# EAGLE schematic traffic-light (EAGLE 9.6.2)
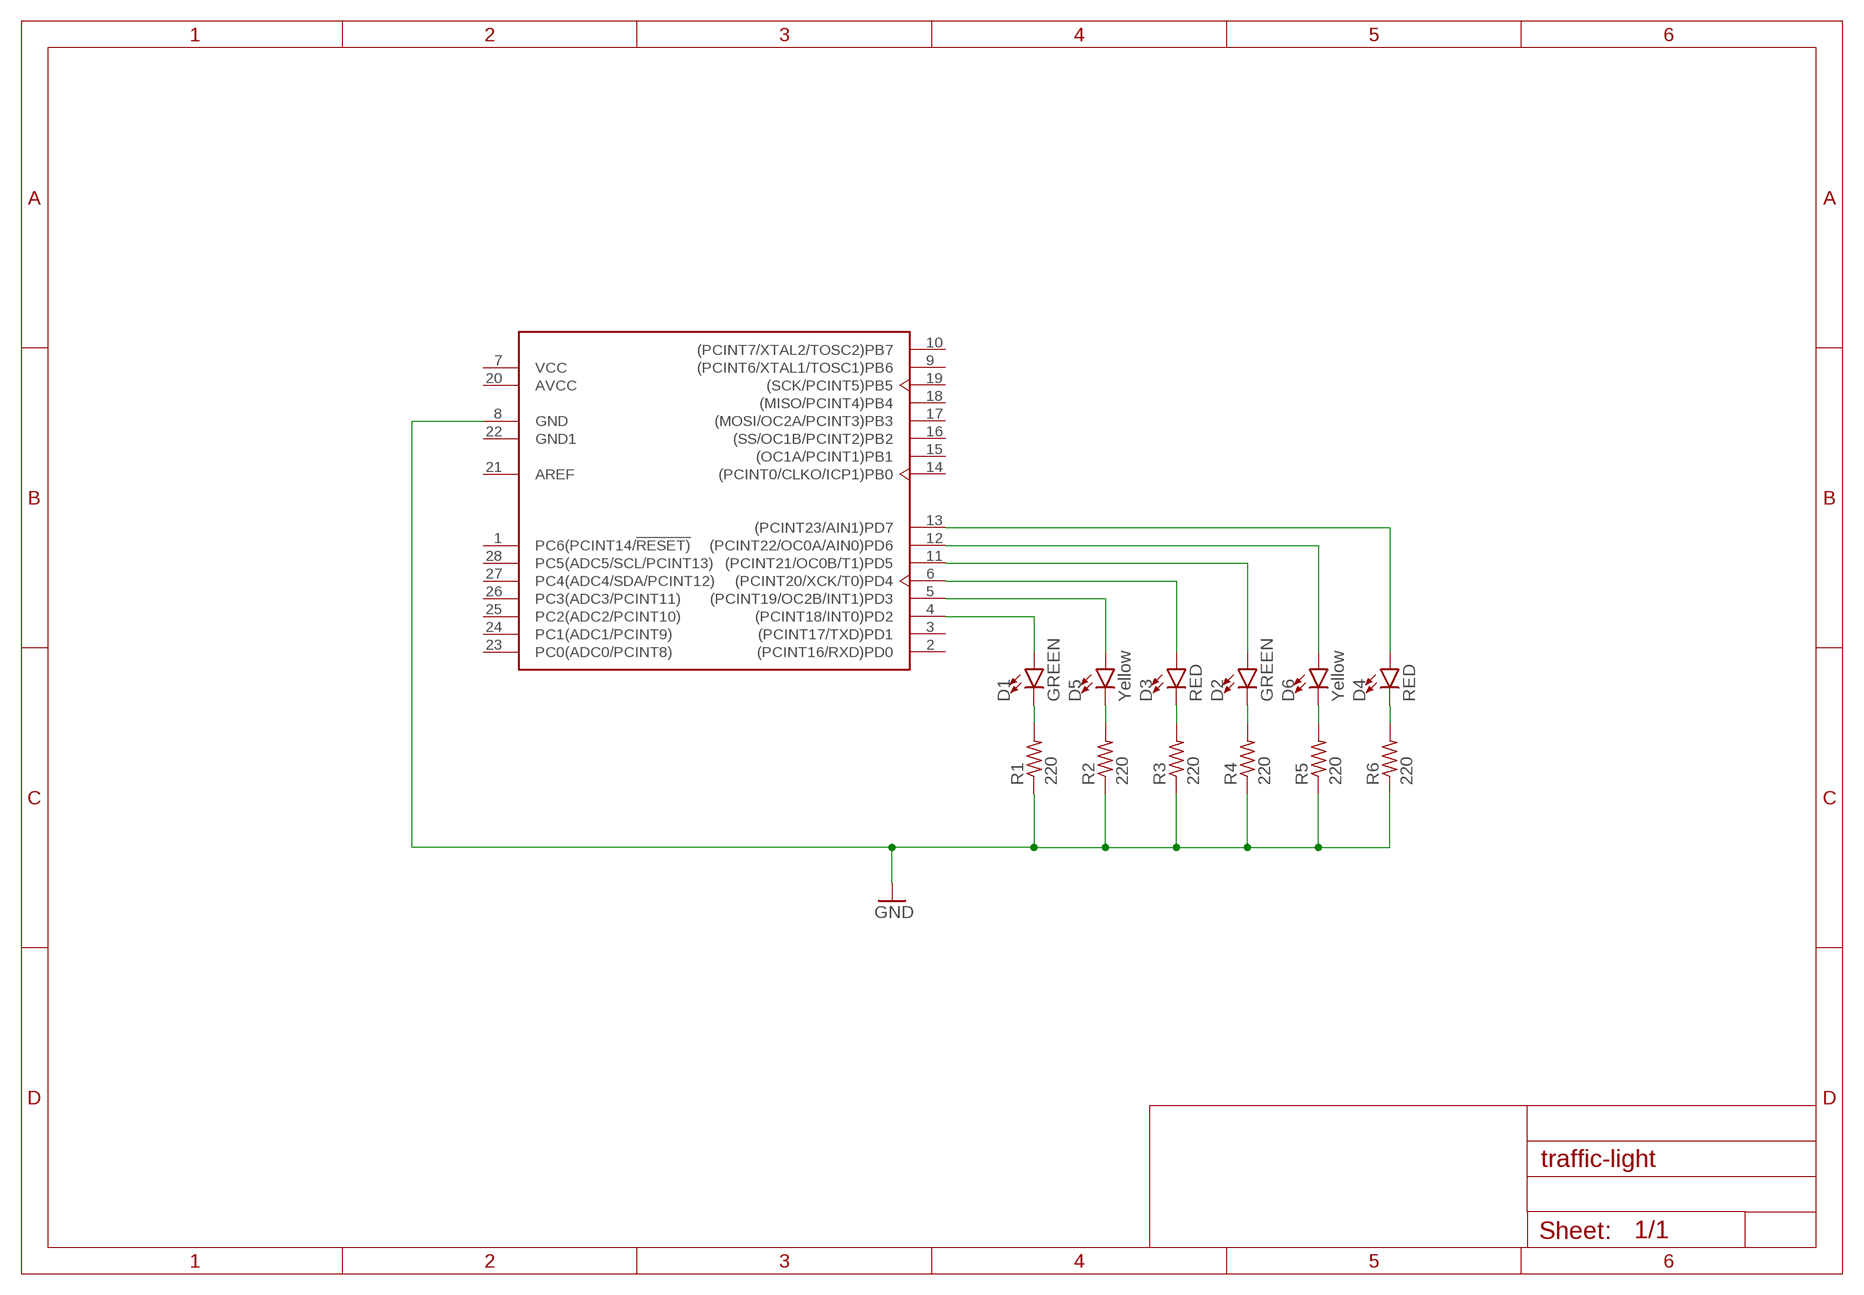
[diagram p0: schematic, sheet 1]

## Parts
D1  GREEN  LED-GREEN0603  [LED-0603]
D2  GREEN  LED-GREEN0603  [LED-0603]
D3  RED  LED-RED0603  [LED-0603]
D4  RED  LED-RED0603  [LED-0603]
D5  Yellow  LED-YELLOW0603  [LED-0603]
D6  Yellow  LED-YELLOW0603  [LED-0603]
R1  220  R-US_0204/7  [0204/7]
R2  220  R-US_0204/7  [0204/7]
R3  220  R-US_0204/7  [0204/7]
R4  220  R-US_0204/7  [0204/7]
R5  220  R-US_0204/7  [0204/7]
R6  220  R-US_0204/7  [0204/7]
U1  ATMEGA328P-PU  [DIP-28]

## Nets
GND: R1.1 R2.1 R3.1 R4.1 R5.1 R6.1 U1.8(GND)
N$1: D1.A U1.4((PCINT18/INT0)PD2)
N$2: D5.A U1.5((PCINT19/OC2B/INT1)PD3)
N$3: D3.A U1.6((PCINT20/XCK/T0)PD4)
N$4: D2.A U1.11((PCINT21/OC0B/T1)PD5)
N$5: D6.A U1.12((PCINT22/OC0A/AIN0)PD6)
N$6: D4.A U1.13((PCINT23/AIN1)PD7)
N$7: D1.C R1.2
N$8: D5.C R2.2
N$9: D3.C R3.2
N$10: D2.C R4.2
N$11: D6.C R5.2
N$12: D4.C R6.2
Unconnected: U1.1(PC6(PCINT14/!RESET)) U1.2((PCINT16/RXD)PD0) U1.3((PCINT17/TXD)PD1) U1.9((PCINT6/XTAL1/TOSC1)PB6) U1.10((PCINT7/XTAL2/TOSC2)PB7) U1.14((PCINT0/CLKO/ICP1)PB0) U1.15((OC1A/PCINT1)PB1) U1.16((SS/OC1B/PCINT2)PB2) U1.17((MOSI/OC2A/PCINT3)PB3) U1.18((MISO/PCINT4)PB4) U1.19((SCK/PCINT5)PB5) U1.21(AREF) U1.23(PC0(ADC0/PCINT8)) U1.24(PC1(ADC1/PCINT9)) U1.25(PC2(ADC2/PCINT10)) U1.26(PC3(ADC3/PCINT11)) U1.27(PC4(ADC4/SDA/PCINT12)) U1.28(PC5(ADC5/SCL/PCINT13))

## Power pins joined to a net without a drawn wire
AVCC: U1.20(AVCC)
GND1: U1.22(GND1)
VCC: U1.7(VCC)

## Library data of the parts
D1 D2 = SparkFun-LED:LED-GREEN: Green SMD LED Used in manufacturing of various products at SparkFun Packages: 0603 - SMD 0603 package [Product Link] <http://www.futureelectronics.com/en/technologies/semiconductors/optoelectronics/leds/Pages/9894312-LTST-C190GKT.aspx?CrossPart=HSMG-C190&IM=0> LilyPad 1206 - SMD1206 LilyPad package [Product Link] <http://www.futureelectronics.com/en/Technologies/Product.aspx?ProductID=IN150NGHARVATEKCORPORATION2049943&IM=0> 1206 - SMD1206 package [Product Link] <http://www.futureelectronics.com/en/technologies/semiconductors/optoelectronics/leds/Pages/8315665-LTST-C150KGKT.aspx?IM=0> 1206 Bottom Mount -SMD 1206 Bottom Mount [Product Link] <http://www.digikey.com/product-detail/en/lite-on-inc/LTST-C230KGKT/160-1456-1-ND/386854> SparkFun Products: Pro Mini 328 -5V <https://www.sparkfun.com/products/821> RedBoard <https://www.sparkfun.com/products/12757> MP3 Trigger <https://www.sparkfun.com/products/13720> Makey Makey <https://www.sparkfun.com/products/11076>; PROD_ID: DIO-00821
D3 D4 = SparkFun-LED:LED-RED: Red SMD LED Used in manufacturing of most products at SparkFun Packages: 0603 - SMD 0603 package [Product Link] <http://docs.avagotech.com/docs/AV02-0551EN> 0603 SMART - SMD 0603 SMART package ( more efficient and expensive)[Product Link] <http://www.osram-os.com/Graphics/XPic2/00077099_0.pdf> 1206 - SMD1206 package [Product Link] <https://www.sparkfun.com/datasheets/DevTools/LilyPad/Q150OVS4.pdff> SparkFun Products: Pro Mini 328 -5V <https://www.sparkfun.com/products/821> RedBoard <https://www.sparkfun.com/products/12757> IOIO-OTG <https://www.sparkfun.com/products/13613>; PROD_ID: DIO-00819
D5 D6 = SparkFun-LED:LED-YELLOW: Yellow SMD LED Used in manufacturing several products at SparkFun. Packages: 0603 - SMD 0603 package[Product Link] <http://www.kingbrightusa.com/product.asp?catalog_name=LED&product_id=APT1608SYCK> 0603 -SMART - SMART SMD 0603 package (more efficient/more expensive) [Product Link] <http://www.osram-os.com/osram_os/en/products/product-catalog/led-light-emitting-diodes/smartled-0603/ly-l29k/index.jsp> LilyPad - SMD1206 package[Product Datasheet] <https://www.sparkfun.com/datasheets/DevTools/LilyPad/Q150YUS4.pdf> SparkFun Products: Blynk Board <https://www.sparkfun.com/products/13794> IOIO-OTG <https://www.sparkfun.com/products/13613> XBee Explorer Serial <https://www.sparkfun.com/products/13225>; PROD_ID: DIO-09003
R1-R6 = rcl:R-US_: RESISTOR, American symbol; SPICEPREFIX: R
U1 = Microcontroller:ATMEGA328P-PU: IC MCU 8BIT 32KB FLASH 28DIP Manufacturer's datasheet <http://ww1.microchip.com/downloads/en/DeviceDoc/ATmega48A-PA-88A-PA-168A-PA-328-P-DS-DS40002061A.pdf>; CREATED_BY: PCBLayout.com; DIGIKEY_PART_NUMBER: ATMEGA328P-PU-ND; MANUFACTURER: Microchip Technology; MPN: ATMEGA328P-PU; PACKAGE: DIP-28

## Module ARDUINO
Ports: 

### Library data of the parts